# Altium schematic sheet Sheet1.SchDoc
size A3
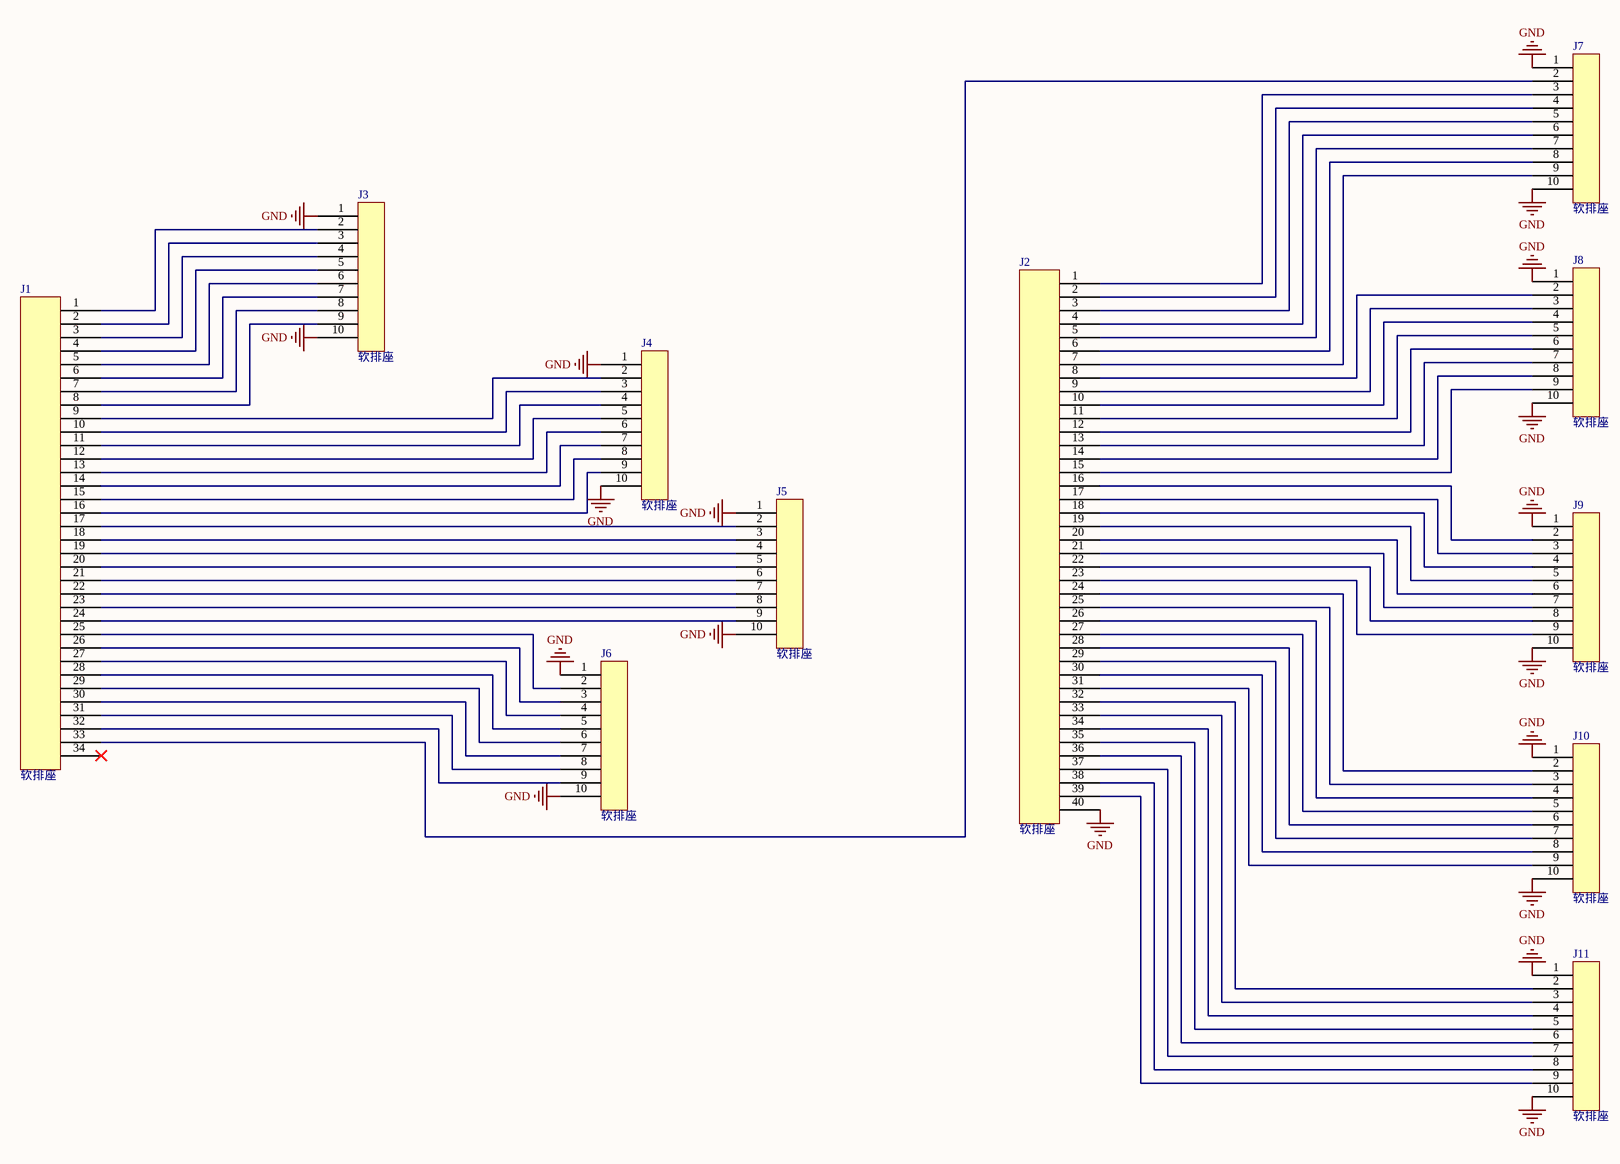
[diagram p0: Sheet1.SchDoc]

## Parts
J1  软排座  [34P软排线]
J2  软排座  [40P软排线]
J3  软排座  [10P软排线(逆)]
J4  软排座  [10P软排线(逆)]
J5  软排座  [10P软排线(逆)]
J6  软排座  [10P软排线(逆)]
J7  软排座  [10P软排线]
J8  软排座  [10P软排线]
J9  软排座  [10P软排线]
J10  软排座  [10P软排线]
J11  软排座  [10P软排线]

## Nets
GND: J2.40 J3.1 J3.10 J4.1 J4.10 J5.1 J5.10 J6.1 J6.10 J7.1 J7.10 J8.1 J8.10 J9.1 J9.10 J10.1 J10.10 J11.1 J11.10
NetJ1_1: J1.1 J3.2
NetJ1_2: J1.2 J3.3
NetJ1_3: J1.3 J3.4
NetJ1_4: J1.4 J3.5
NetJ1_5: J1.5 J3.6
NetJ1_6: J1.6 J3.7
NetJ1_7: J1.7 J3.8
NetJ1_8: J1.8 J3.9
NetJ1_9: J1.9 J4.2
NetJ1_10: J1.10 J4.3
NetJ1_11: J1.11 J4.4
NetJ1_12: J1.12 J4.5
NetJ1_13: J1.13 J4.6
NetJ1_14: J1.14 J4.7
NetJ1_15: J1.15 J4.8
NetJ1_16: J1.16 J4.9
NetJ1_17: J1.17 J5.2
NetJ1_18: J1.18 J5.3
NetJ1_19: J1.19 J5.4
NetJ1_20: J1.20 J5.5
NetJ1_21: J1.21 J5.6
NetJ1_22: J1.22 J5.7
NetJ1_23: J1.23 J5.8
NetJ1_24: J1.24 J5.9
NetJ1_25: J1.25 J6.2
NetJ1_26: J1.26 J6.3
NetJ1_27: J1.27 J6.4
NetJ1_28: J1.28 J6.5
NetJ1_29: J1.29 J6.6
NetJ1_30: J1.30 J6.7
NetJ1_31: J1.31 J6.8
NetJ1_32: J1.32 J6.9
NetJ1_33: J1.33 J7.2
NetJ2_1: J2.1 J7.3
NetJ2_2: J2.2 J7.4
NetJ2_3: J2.3 J7.5
NetJ2_4: J2.4 J7.6
NetJ2_5: J2.5 J7.7
NetJ2_6: J2.6 J7.8
NetJ2_7: J2.7 J7.9
NetJ2_8: J2.8 J8.2
NetJ2_9: J2.9 J8.3
NetJ2_10: J2.10 J8.4
NetJ2_11: J2.11 J8.5
NetJ2_12: J2.12 J8.6
NetJ2_13: J2.13 J8.7
NetJ2_14: J2.14 J8.8
NetJ2_15: J2.15 J8.9
NetJ2_16: J2.16 J9.2
NetJ2_17: J2.17 J9.3
NetJ2_18: J2.18 J9.4
NetJ2_19: J2.19 J9.5
NetJ2_20: J2.20 J9.6
NetJ2_21: J2.21 J9.7
NetJ2_22: J2.22 J9.8
NetJ2_23: J2.23 J9.9
NetJ2_24: J2.24 J10.2
NetJ2_25: J2.25 J10.3
NetJ2_26: J2.26 J10.4
NetJ2_27: J2.27 J10.5
NetJ2_28: J2.28 J10.6
NetJ2_29: J2.29 J10.7
NetJ2_30: J2.30 J10.8
NetJ2_31: J2.31 J10.9
NetJ2_32: J2.32 J11.2
NetJ2_33: J2.33 J11.3
NetJ2_34: J2.34 J11.4
NetJ2_35: J2.35 J11.5
NetJ2_36: J2.36 J11.6
NetJ2_37: J2.37 J11.7
NetJ2_38: J2.38 J11.8
NetJ2_39: J2.39 J11.9

Not connected (* = marked no-connect by the designer): J1 34*

## Library data of the parts
J1 = 34P
J2 = 40P
J3-J11 = 10P